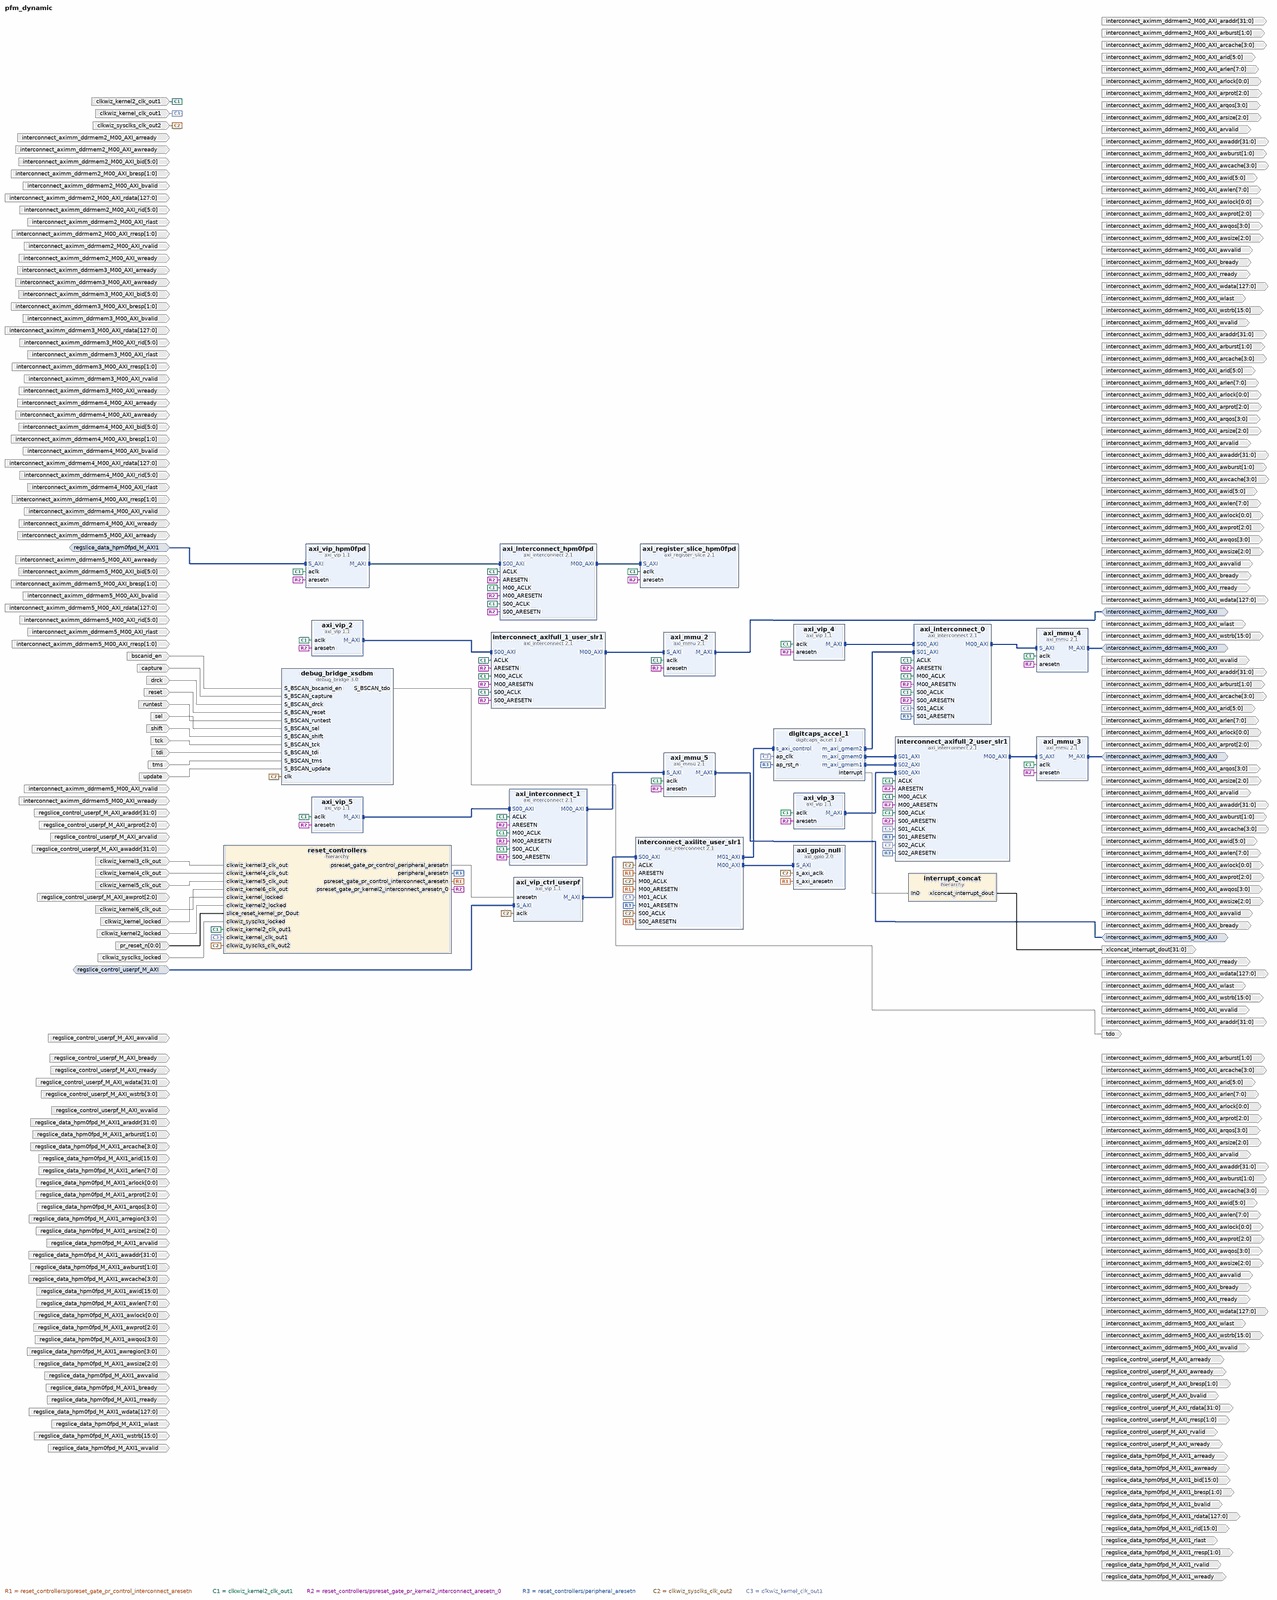
[diagram p0: block diagram of the top level, whole]
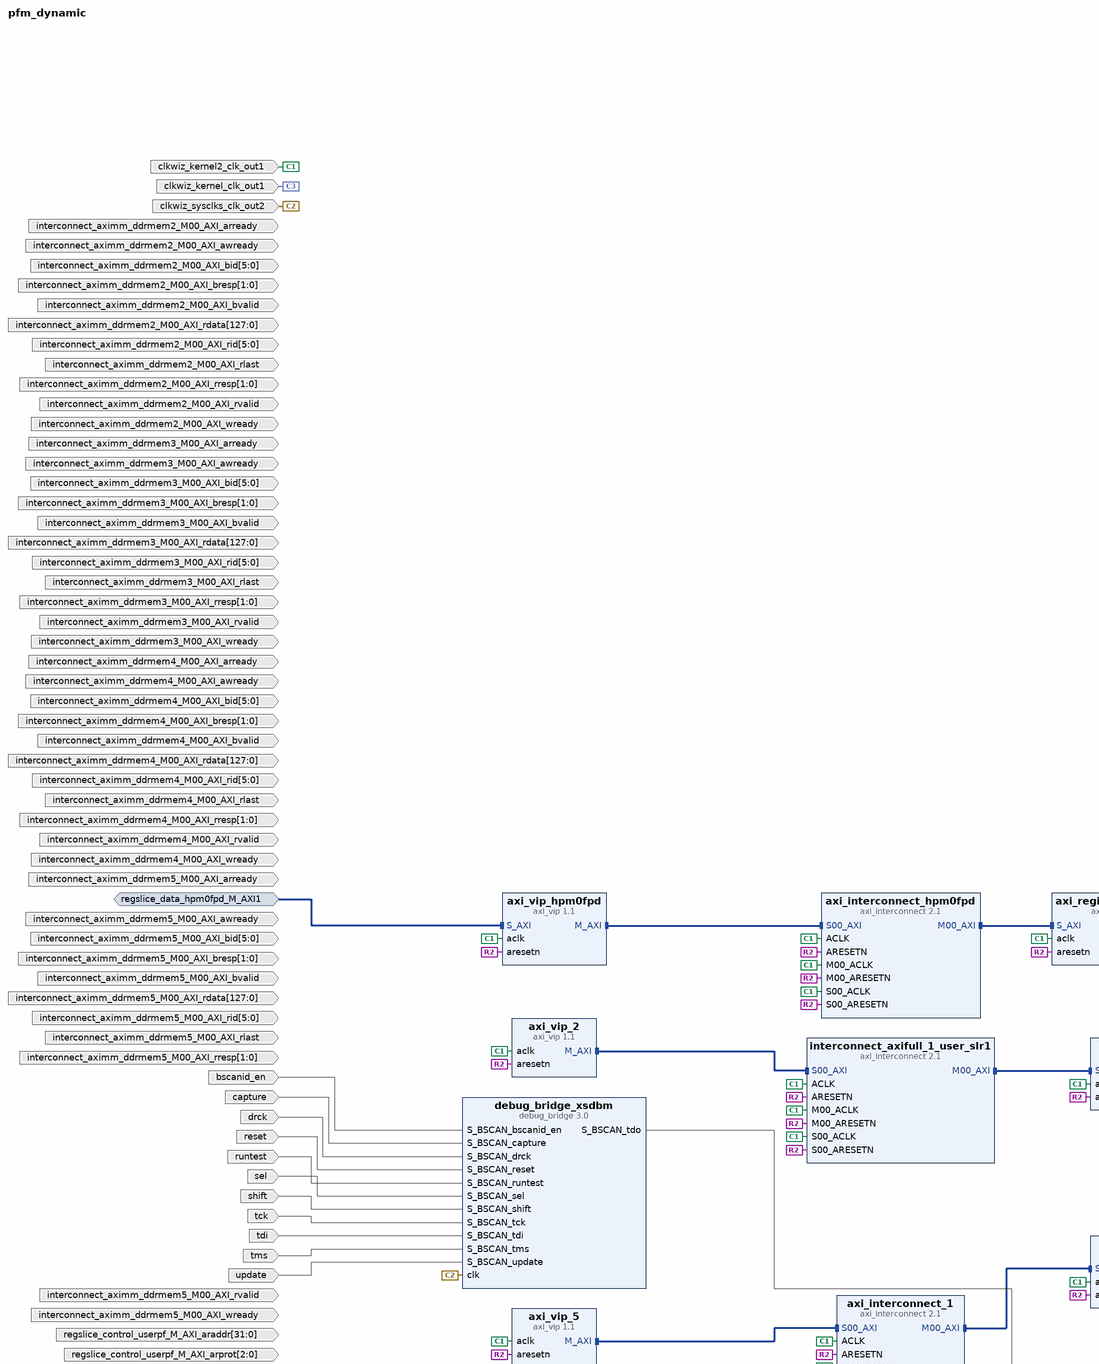
[diagram p1: block diagram of the top level, upper left part]
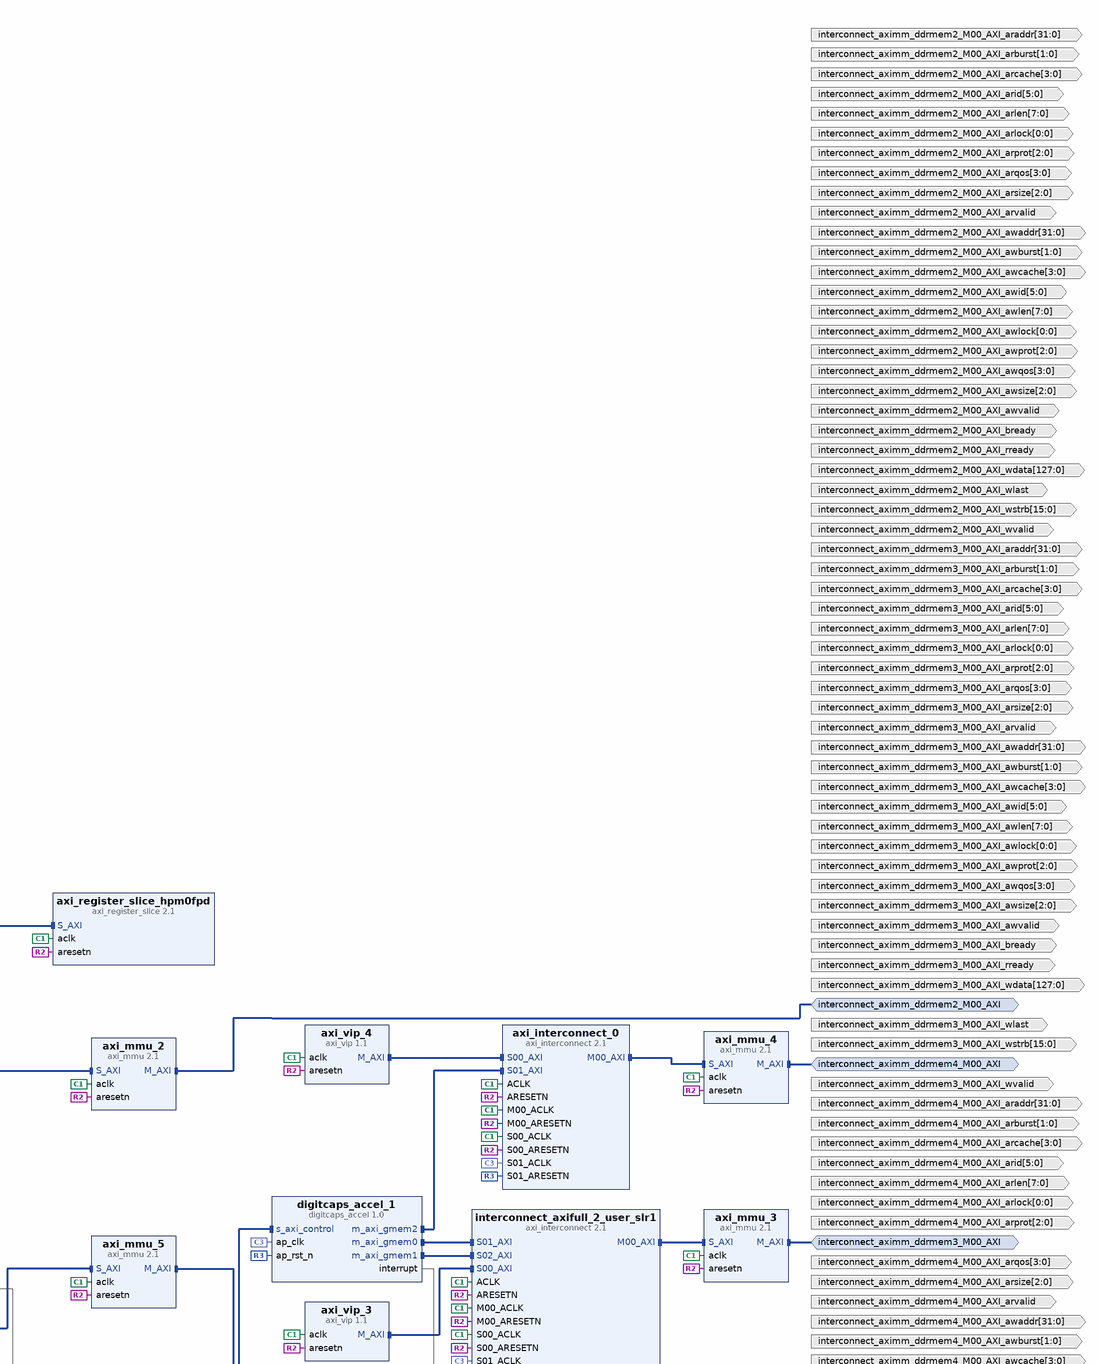
[diagram p2: block diagram of the top level, upper right part]
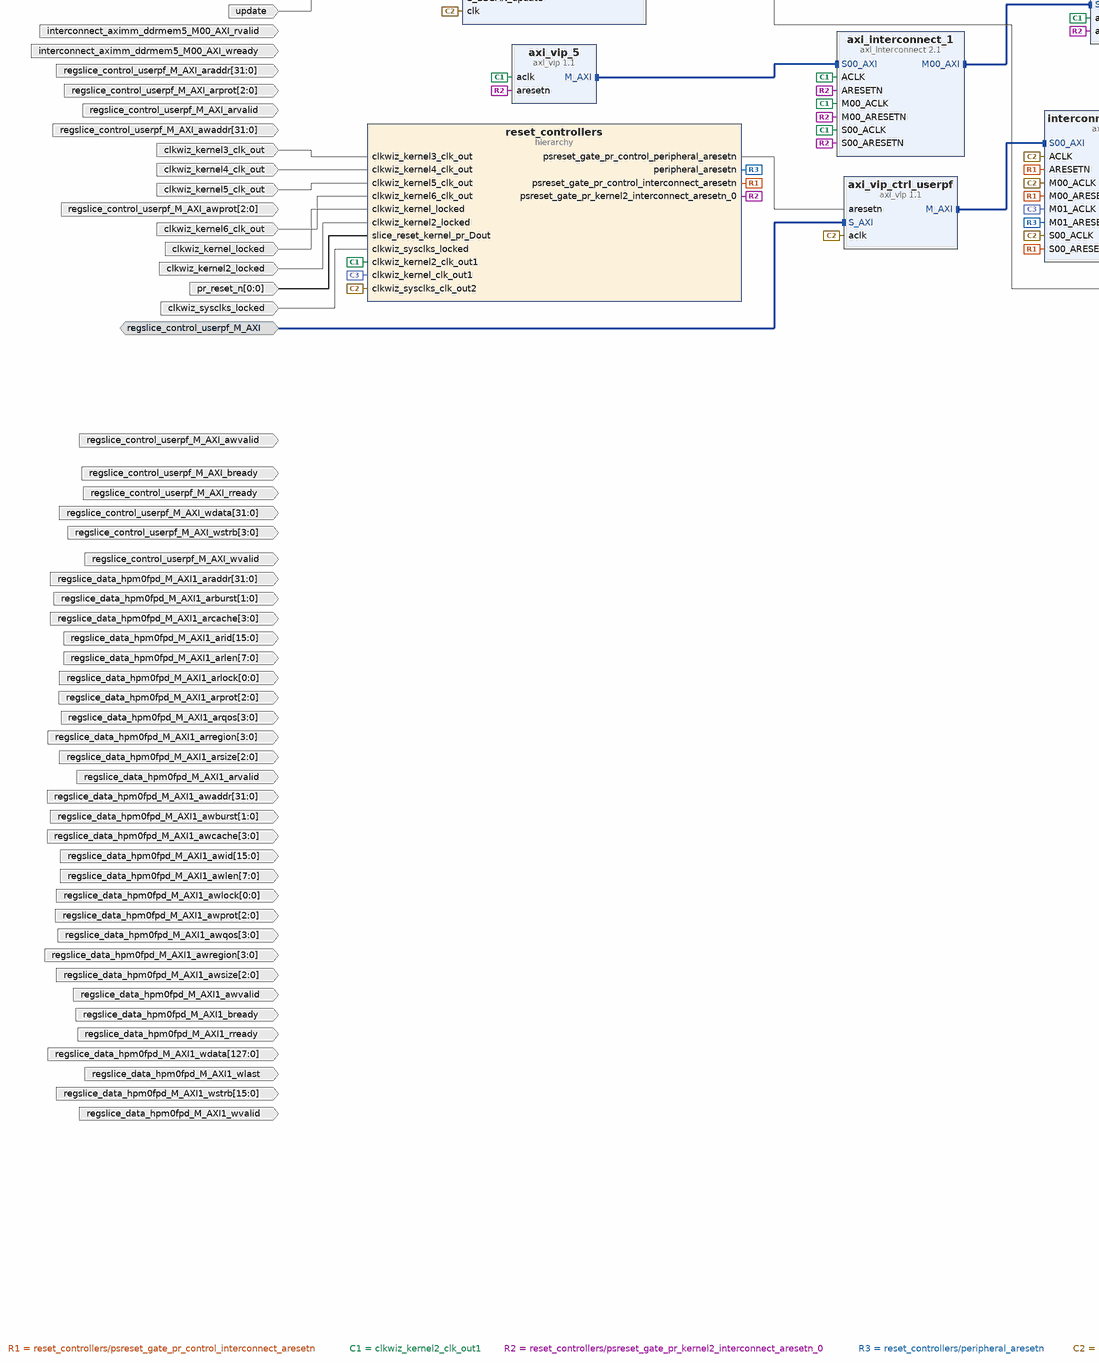
[diagram p3: block diagram of the top level, lower left part]
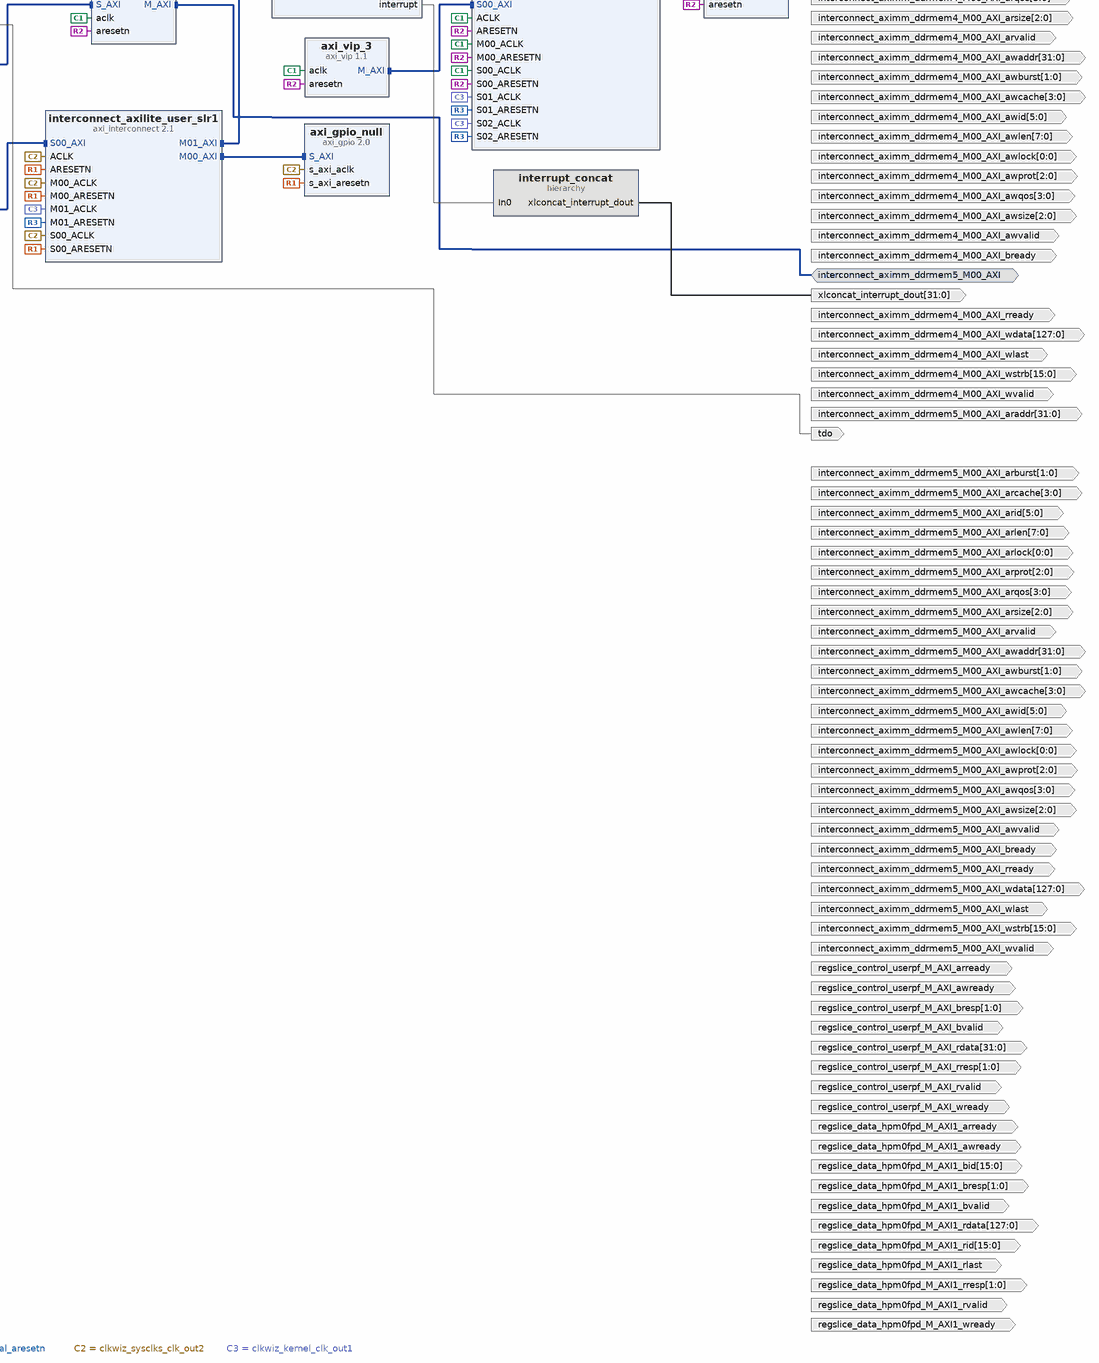
[diagram p4: block diagram of the top level, lower right part]
# Vivado block design pfm_dynamic, xczu9eg-ffvb1156-2-e, Vivado 2022.1
create_bd_design pfm_dynamic

create_bd_intf_port -mode Master -vlnv xilinx.com:interface:aximm_rtl:1.0 interconnect_aximm_ddrmem2_M00_AXI
set_property -dict [list \
  CONFIG.ADDR_WIDTH 32 \
  CONFIG.DATA_WIDTH 128 \
  CONFIG.FREQ_HZ 300000000 \
  CONFIG.HAS_REGION 1 \
  CONFIG.NUM_READ_OUTSTANDING 2 \
  CONFIG.NUM_WRITE_OUTSTANDING 2 \
  CONFIG.PROTOCOL AXI4 \
] [get_bd_intf_ports interconnect_aximm_ddrmem2_M00_AXI]
create_bd_intf_port -mode Master -vlnv xilinx.com:interface:aximm_rtl:1.0 interconnect_aximm_ddrmem3_M00_AXI
set_property -dict [list \
  CONFIG.ADDR_WIDTH 32 \
  CONFIG.DATA_WIDTH 128 \
  CONFIG.FREQ_HZ 300000000 \
  CONFIG.HAS_REGION 1 \
  CONFIG.NUM_READ_OUTSTANDING 2 \
  CONFIG.NUM_WRITE_OUTSTANDING 2 \
  CONFIG.PROTOCOL AXI4 \
] [get_bd_intf_ports interconnect_aximm_ddrmem3_M00_AXI]
create_bd_intf_port -mode Master -vlnv xilinx.com:interface:aximm_rtl:1.0 interconnect_aximm_ddrmem4_M00_AXI
set_property -dict [list \
  CONFIG.ADDR_WIDTH 32 \
  CONFIG.DATA_WIDTH 128 \
  CONFIG.FREQ_HZ 300000000 \
  CONFIG.HAS_REGION 1 \
  CONFIG.NUM_READ_OUTSTANDING 2 \
  CONFIG.NUM_WRITE_OUTSTANDING 2 \
  CONFIG.PROTOCOL AXI4 \
] [get_bd_intf_ports interconnect_aximm_ddrmem4_M00_AXI]
create_bd_intf_port -mode Master -vlnv xilinx.com:interface:aximm_rtl:1.0 interconnect_aximm_ddrmem5_M00_AXI
set_property -dict [list \
  CONFIG.ADDR_WIDTH 32 \
  CONFIG.DATA_WIDTH 128 \
  CONFIG.FREQ_HZ 300000000 \
  CONFIG.HAS_REGION 1 \
  CONFIG.NUM_READ_OUTSTANDING 2 \
  CONFIG.NUM_WRITE_OUTSTANDING 2 \
  CONFIG.PROTOCOL AXI4 \
] [get_bd_intf_ports interconnect_aximm_ddrmem5_M00_AXI]
create_bd_intf_port -mode Slave -vlnv xilinx.com:interface:aximm_rtl:1.0 regslice_control_userpf_M_AXI
set_property -dict [list \
  CONFIG.ADDR_WIDTH 32 \
  CONFIG.ARUSER_WIDTH 0 \
  CONFIG.AWUSER_WIDTH 0 \
  CONFIG.BUSER_WIDTH 0 \
  CONFIG.DATA_WIDTH 32 \
  CONFIG.FREQ_HZ 75000000 \
  CONFIG.HAS_BRESP 1 \
  CONFIG.HAS_BURST 0 \
  CONFIG.HAS_CACHE 0 \
  CONFIG.HAS_LOCK 0 \
  CONFIG.HAS_PROT 1 \
  CONFIG.HAS_QOS 0 \
  CONFIG.HAS_REGION 0 \
  CONFIG.HAS_RRESP 1 \
  CONFIG.HAS_WSTRB 1 \
  CONFIG.ID_WIDTH 0 \
  CONFIG.MAX_BURST_LENGTH 1 \
  CONFIG.NUM_READ_OUTSTANDING 1 \
  CONFIG.NUM_READ_THREADS 1 \
  CONFIG.NUM_WRITE_OUTSTANDING 1 \
  CONFIG.NUM_WRITE_THREADS 1 \
  CONFIG.PROTOCOL AXI4LITE \
  CONFIG.READ_WRITE_MODE READ_WRITE \
  CONFIG.RUSER_BITS_PER_BYTE 0 \
  CONFIG.RUSER_WIDTH 0 \
  CONFIG.SUPPORTS_NARROW_BURST 0 \
  CONFIG.WUSER_BITS_PER_BYTE 0 \
  CONFIG.WUSER_WIDTH 0 \
] [get_bd_intf_ports regslice_control_userpf_M_AXI]
create_bd_intf_port -mode Slave -vlnv xilinx.com:interface:aximm_rtl:1.0 regslice_data_hpm0fpd_M_AXI1
set_property -dict [list \
  CONFIG.ADDR_WIDTH 32 \
  CONFIG.ARUSER_WIDTH 0 \
  CONFIG.AWUSER_WIDTH 0 \
  CONFIG.BUSER_WIDTH 0 \
  CONFIG.DATA_WIDTH 128 \
  CONFIG.FREQ_HZ 300000000 \
  CONFIG.HAS_BRESP 1 \
  CONFIG.HAS_BURST 1 \
  CONFIG.HAS_CACHE 1 \
  CONFIG.HAS_LOCK 1 \
  CONFIG.HAS_PROT 1 \
  CONFIG.HAS_QOS 1 \
  CONFIG.HAS_REGION 1 \
  CONFIG.HAS_RRESP 1 \
  CONFIG.HAS_WSTRB 1 \
  CONFIG.ID_WIDTH 16 \
  CONFIG.MAX_BURST_LENGTH 256 \
  CONFIG.NUM_READ_OUTSTANDING 2 \
  CONFIG.NUM_READ_THREADS 1 \
  CONFIG.NUM_WRITE_OUTSTANDING 2 \
  CONFIG.NUM_WRITE_THREADS 1 \
  CONFIG.PROTOCOL AXI4 \
  CONFIG.READ_WRITE_MODE READ_WRITE \
  CONFIG.RUSER_BITS_PER_BYTE 0 \
  CONFIG.RUSER_WIDTH 0 \
  CONFIG.SUPPORTS_NARROW_BURST 1 \
  CONFIG.WUSER_BITS_PER_BYTE 0 \
  CONFIG.WUSER_WIDTH 0 \
] [get_bd_intf_ports regslice_data_hpm0fpd_M_AXI1]
create_bd_port -dir O -from 5 -to 0 interconnect_aximm_ddrmem3_M00_AXI_awid
create_bd_port -dir O -from 31 -to 0 interconnect_aximm_ddrmem3_M00_AXI_awaddr
create_bd_port -dir O -from 7 -to 0 interconnect_aximm_ddrmem3_M00_AXI_awlen
create_bd_port -dir O -from 2 -to 0 interconnect_aximm_ddrmem3_M00_AXI_awsize
create_bd_port -dir O -from 1 -to 0 interconnect_aximm_ddrmem3_M00_AXI_awburst
create_bd_port -dir O -from 0 -to 0 interconnect_aximm_ddrmem3_M00_AXI_awlock
create_bd_port -dir O -from 3 -to 0 interconnect_aximm_ddrmem3_M00_AXI_awcache
create_bd_port -dir O -from 2 -to 0 interconnect_aximm_ddrmem3_M00_AXI_awprot
create_bd_port -dir O -from 3 -to 0 interconnect_aximm_ddrmem3_M00_AXI_awqos
create_bd_port -dir O interconnect_aximm_ddrmem3_M00_AXI_awvalid
create_bd_port -dir I interconnect_aximm_ddrmem3_M00_AXI_awready
create_bd_port -dir O -from 127 -to 0 interconnect_aximm_ddrmem3_M00_AXI_wdata
create_bd_port -dir O -from 15 -to 0 interconnect_aximm_ddrmem3_M00_AXI_wstrb
create_bd_port -dir O interconnect_aximm_ddrmem3_M00_AXI_wlast
create_bd_port -dir O interconnect_aximm_ddrmem3_M00_AXI_wvalid
create_bd_port -dir I interconnect_aximm_ddrmem3_M00_AXI_wready
create_bd_port -dir I -from 5 -to 0 interconnect_aximm_ddrmem3_M00_AXI_bid
create_bd_port -dir I -from 1 -to 0 interconnect_aximm_ddrmem3_M00_AXI_bresp
create_bd_port -dir I interconnect_aximm_ddrmem3_M00_AXI_bvalid
create_bd_port -dir O interconnect_aximm_ddrmem3_M00_AXI_bready
create_bd_port -dir O -from 5 -to 0 interconnect_aximm_ddrmem3_M00_AXI_arid
create_bd_port -dir O -from 31 -to 0 interconnect_aximm_ddrmem3_M00_AXI_araddr
create_bd_port -dir O -from 7 -to 0 interconnect_aximm_ddrmem3_M00_AXI_arlen
create_bd_port -dir O -from 2 -to 0 interconnect_aximm_ddrmem3_M00_AXI_arsize
create_bd_port -dir O -from 1 -to 0 interconnect_aximm_ddrmem3_M00_AXI_arburst
create_bd_port -dir O -from 0 -to 0 interconnect_aximm_ddrmem3_M00_AXI_arlock
create_bd_port -dir O -from 3 -to 0 interconnect_aximm_ddrmem3_M00_AXI_arcache
create_bd_port -dir O -from 2 -to 0 interconnect_aximm_ddrmem3_M00_AXI_arprot
create_bd_port -dir O -from 3 -to 0 interconnect_aximm_ddrmem3_M00_AXI_arqos
create_bd_port -dir O interconnect_aximm_ddrmem3_M00_AXI_arvalid
create_bd_port -dir I interconnect_aximm_ddrmem3_M00_AXI_arready
create_bd_port -dir I -from 5 -to 0 interconnect_aximm_ddrmem3_M00_AXI_rid
create_bd_port -dir I -from 127 -to 0 interconnect_aximm_ddrmem3_M00_AXI_rdata
create_bd_port -dir I -from 1 -to 0 interconnect_aximm_ddrmem3_M00_AXI_rresp
create_bd_port -dir I interconnect_aximm_ddrmem3_M00_AXI_rlast
create_bd_port -dir I interconnect_aximm_ddrmem3_M00_AXI_rvalid
create_bd_port -dir O interconnect_aximm_ddrmem3_M00_AXI_rready
create_bd_port -dir O -from 5 -to 0 interconnect_aximm_ddrmem2_M00_AXI_awid
create_bd_port -dir O -from 31 -to 0 interconnect_aximm_ddrmem2_M00_AXI_awaddr
create_bd_port -dir O -from 7 -to 0 interconnect_aximm_ddrmem2_M00_AXI_awlen
create_bd_port -dir O -from 2 -to 0 interconnect_aximm_ddrmem2_M00_AXI_awsize
create_bd_port -dir O -from 1 -to 0 interconnect_aximm_ddrmem2_M00_AXI_awburst
create_bd_port -dir O -from 0 -to 0 interconnect_aximm_ddrmem2_M00_AXI_awlock
create_bd_port -dir O -from 3 -to 0 interconnect_aximm_ddrmem2_M00_AXI_awcache
create_bd_port -dir O -from 2 -to 0 interconnect_aximm_ddrmem2_M00_AXI_awprot
create_bd_port -dir O -from 3 -to 0 interconnect_aximm_ddrmem2_M00_AXI_awqos
create_bd_port -dir O interconnect_aximm_ddrmem2_M00_AXI_awvalid
create_bd_port -dir I interconnect_aximm_ddrmem2_M00_AXI_awready
create_bd_port -dir O -from 127 -to 0 interconnect_aximm_ddrmem2_M00_AXI_wdata
create_bd_port -dir O -from 15 -to 0 interconnect_aximm_ddrmem2_M00_AXI_wstrb
create_bd_port -dir O interconnect_aximm_ddrmem2_M00_AXI_wlast
create_bd_port -dir O interconnect_aximm_ddrmem2_M00_AXI_wvalid
create_bd_port -dir I interconnect_aximm_ddrmem2_M00_AXI_wready
create_bd_port -dir I -from 5 -to 0 interconnect_aximm_ddrmem2_M00_AXI_bid
create_bd_port -dir I -from 1 -to 0 interconnect_aximm_ddrmem2_M00_AXI_bresp
create_bd_port -dir I interconnect_aximm_ddrmem2_M00_AXI_bvalid
create_bd_port -dir O interconnect_aximm_ddrmem2_M00_AXI_bready
create_bd_port -dir O -from 5 -to 0 interconnect_aximm_ddrmem2_M00_AXI_arid
create_bd_port -dir O -from 31 -to 0 interconnect_aximm_ddrmem2_M00_AXI_araddr
create_bd_port -dir O -from 7 -to 0 interconnect_aximm_ddrmem2_M00_AXI_arlen
create_bd_port -dir O -from 2 -to 0 interconnect_aximm_ddrmem2_M00_AXI_arsize
create_bd_port -dir O -from 1 -to 0 interconnect_aximm_ddrmem2_M00_AXI_arburst
create_bd_port -dir O -from 0 -to 0 interconnect_aximm_ddrmem2_M00_AXI_arlock
create_bd_port -dir O -from 3 -to 0 interconnect_aximm_ddrmem2_M00_AXI_arcache
create_bd_port -dir O -from 2 -to 0 interconnect_aximm_ddrmem2_M00_AXI_arprot
create_bd_port -dir O -from 3 -to 0 interconnect_aximm_ddrmem2_M00_AXI_arqos
create_bd_port -dir O interconnect_aximm_ddrmem2_M00_AXI_arvalid
create_bd_port -dir I interconnect_aximm_ddrmem2_M00_AXI_arready
create_bd_port -dir I -from 5 -to 0 interconnect_aximm_ddrmem2_M00_AXI_rid
create_bd_port -dir I -from 127 -to 0 interconnect_aximm_ddrmem2_M00_AXI_rdata
create_bd_port -dir I -from 1 -to 0 interconnect_aximm_ddrmem2_M00_AXI_rresp
create_bd_port -dir I interconnect_aximm_ddrmem2_M00_AXI_rlast
create_bd_port -dir I interconnect_aximm_ddrmem2_M00_AXI_rvalid
create_bd_port -dir O interconnect_aximm_ddrmem2_M00_AXI_rready
create_bd_port -dir O -from 5 -to 0 interconnect_aximm_ddrmem4_M00_AXI_awid
create_bd_port -dir O -from 31 -to 0 interconnect_aximm_ddrmem4_M00_AXI_awaddr
create_bd_port -dir O -from 7 -to 0 interconnect_aximm_ddrmem4_M00_AXI_awlen
create_bd_port -dir O -from 2 -to 0 interconnect_aximm_ddrmem4_M00_AXI_awsize
create_bd_port -dir O -from 1 -to 0 interconnect_aximm_ddrmem4_M00_AXI_awburst
create_bd_port -dir O -from 0 -to 0 interconnect_aximm_ddrmem4_M00_AXI_awlock
create_bd_port -dir O -from 3 -to 0 interconnect_aximm_ddrmem4_M00_AXI_awcache
create_bd_port -dir O -from 2 -to 0 interconnect_aximm_ddrmem4_M00_AXI_awprot
create_bd_port -dir O -from 3 -to 0 interconnect_aximm_ddrmem4_M00_AXI_awqos
create_bd_port -dir O interconnect_aximm_ddrmem4_M00_AXI_awvalid
create_bd_port -dir I interconnect_aximm_ddrmem4_M00_AXI_awready
create_bd_port -dir O -from 127 -to 0 interconnect_aximm_ddrmem4_M00_AXI_wdata
create_bd_port -dir O -from 15 -to 0 interconnect_aximm_ddrmem4_M00_AXI_wstrb
create_bd_port -dir O interconnect_aximm_ddrmem4_M00_AXI_wlast
create_bd_port -dir O interconnect_aximm_ddrmem4_M00_AXI_wvalid
create_bd_port -dir I interconnect_aximm_ddrmem4_M00_AXI_wready
create_bd_port -dir I -from 5 -to 0 interconnect_aximm_ddrmem4_M00_AXI_bid
create_bd_port -dir I -from 1 -to 0 interconnect_aximm_ddrmem4_M00_AXI_bresp
create_bd_port -dir I interconnect_aximm_ddrmem4_M00_AXI_bvalid
create_bd_port -dir O interconnect_aximm_ddrmem4_M00_AXI_bready
create_bd_port -dir O -from 5 -to 0 interconnect_aximm_ddrmem4_M00_AXI_arid
create_bd_port -dir O -from 31 -to 0 interconnect_aximm_ddrmem4_M00_AXI_araddr
create_bd_port -dir O -from 7 -to 0 interconnect_aximm_ddrmem4_M00_AXI_arlen
create_bd_port -dir O -from 2 -to 0 interconnect_aximm_ddrmem4_M00_AXI_arsize
create_bd_port -dir O -from 1 -to 0 interconnect_aximm_ddrmem4_M00_AXI_arburst
create_bd_port -dir O -from 0 -to 0 interconnect_aximm_ddrmem4_M00_AXI_arlock
create_bd_port -dir O -from 3 -to 0 interconnect_aximm_ddrmem4_M00_AXI_arcache
create_bd_port -dir O -from 2 -to 0 interconnect_aximm_ddrmem4_M00_AXI_arprot
create_bd_port -dir O -from 3 -to 0 interconnect_aximm_ddrmem4_M00_AXI_arqos
create_bd_port -dir O interconnect_aximm_ddrmem4_M00_AXI_arvalid
create_bd_port -dir I interconnect_aximm_ddrmem4_M00_AXI_arready
create_bd_port -dir I -from 5 -to 0 interconnect_aximm_ddrmem4_M00_AXI_rid
create_bd_port -dir I -from 127 -to 0 interconnect_aximm_ddrmem4_M00_AXI_rdata
create_bd_port -dir I -from 1 -to 0 interconnect_aximm_ddrmem4_M00_AXI_rresp
create_bd_port -dir I interconnect_aximm_ddrmem4_M00_AXI_rlast
create_bd_port -dir I interconnect_aximm_ddrmem4_M00_AXI_rvalid
create_bd_port -dir O interconnect_aximm_ddrmem4_M00_AXI_rready
create_bd_port -dir O -from 5 -to 0 interconnect_aximm_ddrmem5_M00_AXI_awid
create_bd_port -dir O -from 31 -to 0 interconnect_aximm_ddrmem5_M00_AXI_awaddr
create_bd_port -dir O -from 7 -to 0 interconnect_aximm_ddrmem5_M00_AXI_awlen
create_bd_port -dir O -from 2 -to 0 interconnect_aximm_ddrmem5_M00_AXI_awsize
create_bd_port -dir O -from 1 -to 0 interconnect_aximm_ddrmem5_M00_AXI_awburst
create_bd_port -dir O -from 0 -to 0 interconnect_aximm_ddrmem5_M00_AXI_awlock
create_bd_port -dir O -from 3 -to 0 interconnect_aximm_ddrmem5_M00_AXI_awcache
create_bd_port -dir O -from 2 -to 0 interconnect_aximm_ddrmem5_M00_AXI_awprot
create_bd_port -dir O -from 3 -to 0 interconnect_aximm_ddrmem5_M00_AXI_awqos
create_bd_port -dir O interconnect_aximm_ddrmem5_M00_AXI_awvalid
create_bd_port -dir I interconnect_aximm_ddrmem5_M00_AXI_awready
create_bd_port -dir O -from 127 -to 0 interconnect_aximm_ddrmem5_M00_AXI_wdata
create_bd_port -dir O -from 15 -to 0 interconnect_aximm_ddrmem5_M00_AXI_wstrb
create_bd_port -dir O interconnect_aximm_ddrmem5_M00_AXI_wlast
create_bd_port -dir O interconnect_aximm_ddrmem5_M00_AXI_wvalid
create_bd_port -dir I interconnect_aximm_ddrmem5_M00_AXI_wready
create_bd_port -dir I -from 5 -to 0 interconnect_aximm_ddrmem5_M00_AXI_bid
create_bd_port -dir I -from 1 -to 0 interconnect_aximm_ddrmem5_M00_AXI_bresp
create_bd_port -dir I interconnect_aximm_ddrmem5_M00_AXI_bvalid
create_bd_port -dir O interconnect_aximm_ddrmem5_M00_AXI_bready
create_bd_port -dir O -from 5 -to 0 interconnect_aximm_ddrmem5_M00_AXI_arid
create_bd_port -dir O -from 31 -to 0 interconnect_aximm_ddrmem5_M00_AXI_araddr
create_bd_port -dir O -from 7 -to 0 interconnect_aximm_ddrmem5_M00_AXI_arlen
create_bd_port -dir O -from 2 -to 0 interconnect_aximm_ddrmem5_M00_AXI_arsize
create_bd_port -dir O -from 1 -to 0 interconnect_aximm_ddrmem5_M00_AXI_arburst
create_bd_port -dir O -from 0 -to 0 interconnect_aximm_ddrmem5_M00_AXI_arlock
create_bd_port -dir O -from 3 -to 0 interconnect_aximm_ddrmem5_M00_AXI_arcache
create_bd_port -dir O -from 2 -to 0 interconnect_aximm_ddrmem5_M00_AXI_arprot
create_bd_port -dir O -from 3 -to 0 interconnect_aximm_ddrmem5_M00_AXI_arqos
create_bd_port -dir O interconnect_aximm_ddrmem5_M00_AXI_arvalid
create_bd_port -dir I interconnect_aximm_ddrmem5_M00_AXI_arready
create_bd_port -dir I -from 5 -to 0 interconnect_aximm_ddrmem5_M00_AXI_rid
create_bd_port -dir I -from 127 -to 0 interconnect_aximm_ddrmem5_M00_AXI_rdata
create_bd_port -dir I -from 1 -to 0 interconnect_aximm_ddrmem5_M00_AXI_rresp
create_bd_port -dir I interconnect_aximm_ddrmem5_M00_AXI_rlast
create_bd_port -dir I interconnect_aximm_ddrmem5_M00_AXI_rvalid
create_bd_port -dir O interconnect_aximm_ddrmem5_M00_AXI_rready
create_bd_port -dir I -from 31 -to 0 regslice_data_hpm0fpd_M_AXI1_araddr
create_bd_port -dir I -from 1 -to 0 regslice_data_hpm0fpd_M_AXI1_arburst
create_bd_port -dir I -from 3 -to 0 regslice_data_hpm0fpd_M_AXI1_arcache
create_bd_port -dir I -from 7 -to 0 regslice_data_hpm0fpd_M_AXI1_arlen
create_bd_port -dir I -from 0 -to 0 regslice_data_hpm0fpd_M_AXI1_arlock
create_bd_port -dir I -from 2 -to 0 regslice_data_hpm0fpd_M_AXI1_arprot
create_bd_port -dir I -from 3 -to 0 regslice_data_hpm0fpd_M_AXI1_arqos
create_bd_port -dir O regslice_data_hpm0fpd_M_AXI1_arready
create_bd_port -dir I -from 3 -to 0 regslice_data_hpm0fpd_M_AXI1_arregion
create_bd_port -dir I -from 2 -to 0 regslice_data_hpm0fpd_M_AXI1_arsize
create_bd_port -dir I regslice_data_hpm0fpd_M_AXI1_arvalid
create_bd_port -dir I -from 31 -to 0 regslice_data_hpm0fpd_M_AXI1_awaddr
create_bd_port -dir I -from 1 -to 0 regslice_data_hpm0fpd_M_AXI1_awburst
create_bd_port -dir I -from 3 -to 0 regslice_data_hpm0fpd_M_AXI1_awcache
create_bd_port -dir I -from 7 -to 0 regslice_data_hpm0fpd_M_AXI1_awlen
create_bd_port -dir I -from 0 -to 0 regslice_data_hpm0fpd_M_AXI1_awlock
create_bd_port -dir I -from 2 -to 0 regslice_data_hpm0fpd_M_AXI1_awprot
create_bd_port -dir I -from 3 -to 0 regslice_data_hpm0fpd_M_AXI1_awqos
create_bd_port -dir O regslice_data_hpm0fpd_M_AXI1_awready
create_bd_port -dir I -from 3 -to 0 regslice_data_hpm0fpd_M_AXI1_awregion
create_bd_port -dir I -from 2 -to 0 regslice_data_hpm0fpd_M_AXI1_awsize
create_bd_port -dir I regslice_data_hpm0fpd_M_AXI1_awvalid
create_bd_port -dir I regslice_data_hpm0fpd_M_AXI1_bready
create_bd_port -dir O -from 1 -to 0 regslice_data_hpm0fpd_M_AXI1_bresp
create_bd_port -dir O regslice_data_hpm0fpd_M_AXI1_bvalid
create_bd_port -dir O -from 127 -to 0 regslice_data_hpm0fpd_M_AXI1_rdata
create_bd_port -dir O regslice_data_hpm0fpd_M_AXI1_rlast
create_bd_port -dir I regslice_data_hpm0fpd_M_AXI1_rready
create_bd_port -dir O -from 1 -to 0 regslice_data_hpm0fpd_M_AXI1_rresp
create_bd_port -dir O regslice_data_hpm0fpd_M_AXI1_rvalid
create_bd_port -dir I -from 127 -to 0 regslice_data_hpm0fpd_M_AXI1_wdata
create_bd_port -dir I regslice_data_hpm0fpd_M_AXI1_wlast
create_bd_port -dir O regslice_data_hpm0fpd_M_AXI1_wready
create_bd_port -dir I -from 15 -to 0 regslice_data_hpm0fpd_M_AXI1_wstrb
create_bd_port -dir I regslice_data_hpm0fpd_M_AXI1_wvalid
create_bd_port -dir I -from 15 -to 0 regslice_data_hpm0fpd_M_AXI1_arid
create_bd_port -dir I -from 15 -to 0 regslice_data_hpm0fpd_M_AXI1_awid
create_bd_port -dir O -from 15 -to 0 regslice_data_hpm0fpd_M_AXI1_bid
create_bd_port -dir O -from 15 -to 0 regslice_data_hpm0fpd_M_AXI1_rid
create_bd_port -dir I -from 31 -to 0 regslice_control_userpf_M_AXI_araddr
create_bd_port -dir I -from 2 -to 0 regslice_control_userpf_M_AXI_arprot
create_bd_port -dir O regslice_control_userpf_M_AXI_arready
create_bd_port -dir I regslice_control_userpf_M_AXI_arvalid
create_bd_port -dir I -from 31 -to 0 regslice_control_userpf_M_AXI_awaddr
create_bd_port -dir I -from 2 -to 0 regslice_control_userpf_M_AXI_awprot
create_bd_port -dir O regslice_control_userpf_M_AXI_awready
create_bd_port -dir I regslice_control_userpf_M_AXI_awvalid
create_bd_port -dir I regslice_control_userpf_M_AXI_bready
create_bd_port -dir O -from 1 -to 0 regslice_control_userpf_M_AXI_bresp
create_bd_port -dir O regslice_control_userpf_M_AXI_bvalid
create_bd_port -dir O -from 31 -to 0 regslice_control_userpf_M_AXI_rdata
create_bd_port -dir I regslice_control_userpf_M_AXI_rready
create_bd_port -dir O -from 1 -to 0 regslice_control_userpf_M_AXI_rresp
create_bd_port -dir O regslice_control_userpf_M_AXI_rvalid
create_bd_port -dir I -from 31 -to 0 regslice_control_userpf_M_AXI_wdata
create_bd_port -dir O regslice_control_userpf_M_AXI_wready
create_bd_port -dir I -from 3 -to 0 regslice_control_userpf_M_AXI_wstrb
create_bd_port -dir I regslice_control_userpf_M_AXI_wvalid
create_bd_port -dir I bscanid_en
create_bd_port -dir I capture
create_bd_port -dir I -type clk clkwiz_kernel2_clk_out1
set_property -dict {CONFIG.FREQ_HZ 300000000} [get_bd_ports clkwiz_kernel2_clk_out1]
create_bd_port -dir I clkwiz_kernel2_locked
create_bd_port -dir I -type clk clkwiz_kernel3_clk_out
set_property -dict {CONFIG.FREQ_HZ 100000000} [get_bd_ports clkwiz_kernel3_clk_out]
create_bd_port -dir I -type clk clkwiz_kernel4_clk_out
set_property -dict {CONFIG.FREQ_HZ 200000000} [get_bd_ports clkwiz_kernel4_clk_out]
create_bd_port -dir I -type clk clkwiz_kernel5_clk_out
set_property -dict {CONFIG.FREQ_HZ 400000000} [get_bd_ports clkwiz_kernel5_clk_out]
create_bd_port -dir I -type clk clkwiz_kernel6_clk_out
set_property -dict {CONFIG.FREQ_HZ 600000000} [get_bd_ports clkwiz_kernel6_clk_out]
create_bd_port -dir I -type clk clkwiz_kernel_clk_out1
set_property -dict {CONFIG.FREQ_HZ 150000000} [get_bd_ports clkwiz_kernel_clk_out1]
create_bd_port -dir I clkwiz_kernel_locked
create_bd_port -dir I -type clk clkwiz_sysclks_clk_out2
set_property -dict {CONFIG.FREQ_HZ 75000000} [get_bd_ports clkwiz_sysclks_clk_out2]
create_bd_port -dir I -type rst clkwiz_sysclks_locked
create_bd_port -dir I drck
create_bd_port -dir I -from 0 -to 0 -type rst pr_reset_n
create_bd_port -dir I reset
create_bd_port -dir I runtest
create_bd_port -dir I sel
create_bd_port -dir I shift
create_bd_port -dir I tck
create_bd_port -dir I tdi
create_bd_port -dir O tdo
create_bd_port -dir I tms
create_bd_port -dir I update
create_bd_port -dir O -from 31 -to 0 xlconcat_interrupt_dout

create_bd_cell -type ip -vlnv xilinx.com:ip:axi_gpio:2.0 axi_gpio_null
create_bd_cell -type ip -vlnv xilinx.com:ip:axi_mmu:2.1 axi_mmu_2
set_property -dict {CONFIG.D000_ADDR_WIDTH 32 CONFIG.ID_WIDTH 6} [get_bd_cells axi_mmu_2]
create_bd_cell -type ip -vlnv xilinx.com:ip:axi_mmu:2.1 axi_mmu_3
set_property -dict {CONFIG.D000_ADDR_WIDTH 32 CONFIG.ID_WIDTH 6} [get_bd_cells axi_mmu_3]
create_bd_cell -type ip -vlnv xilinx.com:ip:axi_mmu:2.1 axi_mmu_4
set_property -dict {CONFIG.D000_ADDR_WIDTH 32 CONFIG.ID_WIDTH 6} [get_bd_cells axi_mmu_4]
create_bd_cell -type ip -vlnv xilinx.com:ip:axi_mmu:2.1 axi_mmu_5
set_property -dict {CONFIG.D000_ADDR_WIDTH 32 CONFIG.ID_WIDTH 6} [get_bd_cells axi_mmu_5]
create_bd_cell -type ip -vlnv xilinx.com:ip:axi_register_slice:2.1 axi_register_slice_hpm0fpd
set_property -dict {CONFIG.DATA_WIDTH 128} [get_bd_cells axi_register_slice_hpm0fpd]
create_bd_cell -type ip -vlnv xilinx.com:ip:axi_vip:1.1 axi_vip_2
set_property -dict [list \
  CONFIG.ADDR_WIDTH 32 \
  CONFIG.ARUSER_WIDTH 0 \
  CONFIG.AWUSER_WIDTH 0 \
  CONFIG.BUSER_WIDTH 0 \
  CONFIG.DATA_WIDTH 128 \
  CONFIG.HAS_BRESP 1 \
  CONFIG.HAS_BURST 1 \
  CONFIG.HAS_CACHE 1 \
  CONFIG.HAS_LOCK 1 \
  CONFIG.HAS_PROT 1 \
  CONFIG.HAS_QOS 1 \
  CONFIG.HAS_REGION 1 \
  CONFIG.HAS_RRESP 1 \
  CONFIG.HAS_WSTRB 1 \
  CONFIG.ID_WIDTH 0 \
  CONFIG.INTERFACE_MODE MASTER \
  CONFIG.PROTOCOL AXI4 \
  CONFIG.READ_WRITE_MODE READ_WRITE \
  CONFIG.RUSER_WIDTH 0 \
  CONFIG.SUPPORTS_NARROW 1 \
  CONFIG.WUSER_WIDTH 0 \
] [get_bd_cells axi_vip_2]
create_bd_cell -type ip -vlnv xilinx.com:ip:axi_vip:1.1 axi_vip_3
set_property -dict [list \
  CONFIG.ADDR_WIDTH 32 \
  CONFIG.ARUSER_WIDTH 0 \
  CONFIG.AWUSER_WIDTH 0 \
  CONFIG.BUSER_WIDTH 0 \
  CONFIG.DATA_WIDTH 128 \
  CONFIG.HAS_BRESP 1 \
  CONFIG.HAS_BURST 1 \
  CONFIG.HAS_CACHE 1 \
  CONFIG.HAS_LOCK 1 \
  CONFIG.HAS_PROT 1 \
  CONFIG.HAS_QOS 1 \
  CONFIG.HAS_REGION 1 \
  CONFIG.HAS_RRESP 1 \
  CONFIG.HAS_WSTRB 1 \
  CONFIG.ID_WIDTH 0 \
  CONFIG.INTERFACE_MODE MASTER \
  CONFIG.PROTOCOL AXI4 \
  CONFIG.READ_WRITE_MODE READ_WRITE \
  CONFIG.RUSER_WIDTH 0 \
  CONFIG.SUPPORTS_NARROW 1 \
  CONFIG.WUSER_WIDTH 0 \
] [get_bd_cells axi_vip_3]
create_bd_cell -type ip -vlnv xilinx.com:ip:axi_vip:1.1 axi_vip_4
set_property -dict [list \
  CONFIG.ADDR_WIDTH 32 \
  CONFIG.ARUSER_WIDTH 0 \
  CONFIG.AWUSER_WIDTH 0 \
  CONFIG.BUSER_WIDTH 0 \
  CONFIG.DATA_WIDTH 128 \
  CONFIG.HAS_BRESP 1 \
  CONFIG.HAS_BURST 1 \
  CONFIG.HAS_CACHE 1 \
  CONFIG.HAS_LOCK 1 \
  CONFIG.HAS_PROT 1 \
  CONFIG.HAS_QOS 1 \
  CONFIG.HAS_REGION 1 \
  CONFIG.HAS_RRESP 1 \
  CONFIG.HAS_WSTRB 1 \
  CONFIG.ID_WIDTH 0 \
  CONFIG.INTERFACE_MODE MASTER \
  CONFIG.PROTOCOL AXI4 \
  CONFIG.READ_WRITE_MODE READ_WRITE \
  CONFIG.RUSER_WIDTH 0 \
  CONFIG.SUPPORTS_NARROW 1 \
  CONFIG.WUSER_WIDTH 0 \
] [get_bd_cells axi_vip_4]
create_bd_cell -type ip -vlnv xilinx.com:ip:axi_vip:1.1 axi_vip_5
set_property -dict [list \
  CONFIG.ADDR_WIDTH 32 \
  CONFIG.ARUSER_WIDTH 0 \
  CONFIG.AWUSER_WIDTH 0 \
  CONFIG.BUSER_WIDTH 0 \
  CONFIG.DATA_WIDTH 128 \
  CONFIG.HAS_BRESP 1 \
  CONFIG.HAS_BURST 1 \
  CONFIG.HAS_CACHE 1 \
  CONFIG.HAS_LOCK 1 \
  CONFIG.HAS_PROT 1 \
  CONFIG.HAS_QOS 1 \
  CONFIG.HAS_REGION 1 \
  CONFIG.HAS_RRESP 1 \
  CONFIG.HAS_WSTRB 1 \
  CONFIG.ID_WIDTH 0 \
  CONFIG.INTERFACE_MODE MASTER \
  CONFIG.PROTOCOL AXI4 \
  CONFIG.READ_WRITE_MODE READ_WRITE \
  CONFIG.RUSER_WIDTH 0 \
  CONFIG.SUPPORTS_NARROW 1 \
  CONFIG.WUSER_WIDTH 0 \
] [get_bd_cells axi_vip_5]
create_bd_cell -type ip -vlnv xilinx.com:ip:axi_vip:1.1 axi_vip_ctrl_userpf
create_bd_cell -type ip -vlnv xilinx.com:ip:axi_vip:1.1 axi_vip_hpm0fpd
create_bd_cell -type ip -vlnv xilinx.com:ip:debug_bridge:3.0 debug_bridge_xsdbm
set_property -dict [list \
  CONFIG.C_DEBUG_MODE 1 \
  CONFIG.C_DESIGN_TYPE 1 \
  CONFIG.C_ENABLE_CLK_DIVIDER false \
] [get_bd_cells debug_bridge_xsdbm]
create_bd_cell -type hier interrupt_concat
create_bd_cell -type hier reset_controllers
create_bd_cell -type ip -vlnv xilinx.com:ip:axi_interconnect:2.1 axi_interconnect_0
set_property -dict [list \
  CONFIG.M00_HAS_REGSLICE 4 \
  CONFIG.M01_HAS_REGSLICE 4 \
  CONFIG.M02_HAS_REGSLICE 4 \
  CONFIG.M03_HAS_REGSLICE 4 \
  CONFIG.M04_HAS_REGSLICE 4 \
  CONFIG.M05_HAS_REGSLICE 4 \
  CONFIG.M06_HAS_REGSLICE 4 \
  CONFIG.M07_HAS_REGSLICE 4 \
  CONFIG.M08_HAS_REGSLICE 4 \
  CONFIG.M09_HAS_REGSLICE 4 \
  CONFIG.M10_HAS_REGSLICE 4 \
  CONFIG.M11_HAS_REGSLICE 4 \
  CONFIG.M12_HAS_REGSLICE 4 \
  CONFIG.M13_HAS_REGSLICE 4 \
  CONFIG.M14_HAS_REGSLICE 4 \
  CONFIG.M15_HAS_REGSLICE 4 \
  CONFIG.M16_HAS_REGSLICE 4 \
  CONFIG.M17_HAS_REGSLICE 4 \
  CONFIG.M18_HAS_REGSLICE 4 \
  CONFIG.M19_HAS_REGSLICE 4 \
  CONFIG.M20_HAS_REGSLICE 4 \
  CONFIG.M21_HAS_REGSLICE 4 \
  CONFIG.M22_HAS_REGSLICE 4 \
  CONFIG.M23_HAS_REGSLICE 4 \
  CONFIG.M24_HAS_REGSLICE 4 \
  CONFIG.M25_HAS_REGSLICE 4 \
  CONFIG.M26_HAS_REGSLICE 4 \
  CONFIG.M27_HAS_REGSLICE 4 \
  CONFIG.M28_HAS_REGSLICE 4 \
  CONFIG.M29_HAS_REGSLICE 4 \
  CONFIG.M30_HAS_REGSLICE 4 \
  CONFIG.M31_HAS_REGSLICE 4 \
  CONFIG.M32_HAS_REGSLICE 4 \
  CONFIG.M33_HAS_REGSLICE 4 \
  CONFIG.M34_HAS_REGSLICE 4 \
  CONFIG.M35_HAS_REGSLICE 4 \
  CONFIG.M36_HAS_REGSLICE 4 \
  CONFIG.M37_HAS_REGSLICE 4 \
  CONFIG.M38_HAS_REGSLICE 4 \
  CONFIG.M39_HAS_REGSLICE 4 \
  CONFIG.M40_HAS_REGSLICE 4 \
  CONFIG.M41_HAS_REGSLICE 4 \
  CONFIG.M42_HAS_REGSLICE 4 \
  CONFIG.M43_HAS_REGSLICE 4 \
  CONFIG.M44_HAS_REGSLICE 4 \
  CONFIG.M45_HAS_REGSLICE 4 \
  CONFIG.M46_HAS_REGSLICE 4 \
  CONFIG.M47_HAS_REGSLICE 4 \
  CONFIG.M48_HAS_REGSLICE 4 \
  CONFIG.M49_HAS_REGSLICE 4 \
  CONFIG.M50_HAS_REGSLICE 4 \
  CONFIG.M51_HAS_REGSLICE 4 \
  CONFIG.M52_HAS_REGSLICE 4 \
  CONFIG.M53_HAS_REGSLICE 4 \
  CONFIG.M54_HAS_REGSLICE 4 \
  CONFIG.M55_HAS_REGSLICE 4 \
  CONFIG.M56_HAS_REGSLICE 4 \
  CONFIG.M57_HAS_REGSLICE 4 \
  CONFIG.M58_HAS_REGSLICE 4 \
  CONFIG.M59_HAS_REGSLICE 4 \
  CONFIG.M60_HAS_REGSLICE 4 \
  CONFIG.M61_HAS_REGSLICE 4 \
  CONFIG.M62_HAS_REGSLICE 4 \
  CONFIG.M63_HAS_REGSLICE 4 \
  CONFIG.NUM_MI 1 \
  CONFIG.NUM_SI 2 \
  CONFIG.S00_HAS_REGSLICE 4 \
  CONFIG.S01_HAS_DATA_FIFO 2 \
  CONFIG.S01_HAS_REGSLICE 1 \
] [get_bd_cells axi_interconnect_0]
create_bd_cell -type ip -vlnv xilinx.com:ip:axi_interconnect:2.1 axi_interconnect_1
set_property -dict [list \
  CONFIG.M00_HAS_REGSLICE 4 \
  CONFIG.M01_HAS_REGSLICE 4 \
  CONFIG.M02_HAS_REGSLICE 4 \
  CONFIG.M03_HAS_REGSLICE 4 \
  CONFIG.M04_HAS_REGSLICE 4 \
  CONFIG.M05_HAS_REGSLICE 4 \
  CONFIG.M06_HAS_REGSLICE 4 \
  CONFIG.M07_HAS_REGSLICE 4 \
  CONFIG.M08_HAS_REGSLICE 4 \
  CONFIG.M09_HAS_REGSLICE 4 \
  CONFIG.M10_HAS_REGSLICE 4 \
  CONFIG.M11_HAS_REGSLICE 4 \
  CONFIG.M12_HAS_REGSLICE 4 \
  CONFIG.M13_HAS_REGSLICE 4 \
  CONFIG.M14_HAS_REGSLICE 4 \
  CONFIG.M15_HAS_REGSLICE 4 \
  CONFIG.M16_HAS_REGSLICE 4 \
  CONFIG.M17_HAS_REGSLICE 4 \
  CONFIG.M18_HAS_REGSLICE 4 \
  CONFIG.M19_HAS_REGSLICE 4 \
  CONFIG.M20_HAS_REGSLICE 4 \
  CONFIG.M21_HAS_REGSLICE 4 \
  CONFIG.M22_HAS_REGSLICE 4 \
  CONFIG.M23_HAS_REGSLICE 4 \
  CONFIG.M24_HAS_REGSLICE 4 \
  CONFIG.M25_HAS_REGSLICE 4 \
  CONFIG.M26_HAS_REGSLICE 4 \
  CONFIG.M27_HAS_REGSLICE 4 \
  CONFIG.M28_HAS_REGSLICE 4 \
  CONFIG.M29_HAS_REGSLICE 4 \
  CONFIG.M30_HAS_REGSLICE 4 \
  CONFIG.M31_HAS_REGSLICE 4 \
  CONFIG.M32_HAS_REGSLICE 4 \
  CONFIG.M33_HAS_REGSLICE 4 \
  CONFIG.M34_HAS_REGSLICE 4 \
  CONFIG.M35_HAS_REGSLICE 4 \
  CONFIG.M36_HAS_REGSLICE 4 \
  CONFIG.M37_HAS_REGSLICE 4 \
  CONFIG.M38_HAS_REGSLICE 4 \
  CONFIG.M39_HAS_REGSLICE 4 \
  CONFIG.M40_HAS_REGSLICE 4 \
  CONFIG.M41_HAS_REGSLICE 4 \
  CONFIG.M42_HAS_REGSLICE 4 \
  CONFIG.M43_HAS_REGSLICE 4 \
  CONFIG.M44_HAS_REGSLICE 4 \
  CONFIG.M45_HAS_REGSLICE 4 \
  CONFIG.M46_HAS_REGSLICE 4 \
  CONFIG.M47_HAS_REGSLICE 4 \
  CONFIG.M48_HAS_REGSLICE 4 \
  CONFIG.M49_HAS_REGSLICE 4 \
  CONFIG.M50_HAS_REGSLICE 4 \
  CONFIG.M51_HAS_REGSLICE 4 \
  CONFIG.M52_HAS_REGSLICE 4 \
  CONFIG.M53_HAS_REGSLICE 4 \
  CONFIG.M54_HAS_REGSLICE 4 \
  CONFIG.M55_HAS_REGSLICE 4 \
  CONFIG.M56_HAS_REGSLICE 4 \
  CONFIG.M57_HAS_REGSLICE 4 \
  CONFIG.M58_HAS_REGSLICE 4 \
  CONFIG.M59_HAS_REGSLICE 4 \
  CONFIG.M60_HAS_REGSLICE 4 \
  CONFIG.M61_HAS_REGSLICE 4 \
  CONFIG.M62_HAS_REGSLICE 4 \
  CONFIG.M63_HAS_REGSLICE 4 \
  CONFIG.NUM_MI 1 \
  CONFIG.NUM_SI 1 \
  CONFIG.S00_HAS_REGSLICE 4 \
] [get_bd_cells axi_interconnect_1]
create_bd_cell -type ip -vlnv xilinx.com:ip:axi_interconnect:2.1 axi_interconnect_hpm0fpd
set_property -dict [list \
  CONFIG.M00_HAS_REGSLICE 4 \
  CONFIG.M01_HAS_REGSLICE 4 \
  CONFIG.M02_HAS_REGSLICE 4 \
  CONFIG.M03_HAS_REGSLICE 4 \
  CONFIG.M04_HAS_REGSLICE 4 \
  CONFIG.M05_HAS_REGSLICE 4 \
  CONFIG.M06_HAS_REGSLICE 4 \
  CONFIG.M07_HAS_REGSLICE 4 \
  CONFIG.M08_HAS_REGSLICE 4 \
  CONFIG.M09_HAS_REGSLICE 4 \
  CONFIG.M10_HAS_REGSLICE 4 \
  CONFIG.M11_HAS_REGSLICE 4 \
  CONFIG.M12_HAS_REGSLICE 4 \
  CONFIG.M13_HAS_REGSLICE 4 \
  CONFIG.M14_HAS_REGSLICE 4 \
  CONFIG.M15_HAS_REGSLICE 4 \
  CONFIG.M16_HAS_REGSLICE 4 \
  CONFIG.M17_HAS_REGSLICE 4 \
  CONFIG.M18_HAS_REGSLICE 4 \
  CONFIG.M19_HAS_REGSLICE 4 \
  CONFIG.M20_HAS_REGSLICE 4 \
  CONFIG.M21_HAS_REGSLICE 4 \
  CONFIG.M22_HAS_REGSLICE 4 \
  CONFIG.M23_HAS_REGSLICE 4 \
  CONFIG.M24_HAS_REGSLICE 4 \
  CONFIG.M25_HAS_REGSLICE 4 \
  CONFIG.M26_HAS_REGSLICE 4 \
  CONFIG.M27_HAS_REGSLICE 4 \
  CONFIG.M28_HAS_REGSLICE 4 \
  CONFIG.M29_HAS_REGSLICE 4 \
  CONFIG.M30_HAS_REGSLICE 4 \
  CONFIG.M31_HAS_REGSLICE 4 \
  CONFIG.M32_HAS_REGSLICE 4 \
  CONFIG.M33_HAS_REGSLICE 4 \
  CONFIG.M34_HAS_REGSLICE 4 \
  CONFIG.M35_HAS_REGSLICE 4 \
  CONFIG.M36_HAS_REGSLICE 4 \
  CONFIG.M37_HAS_REGSLICE 4 \
  CONFIG.M38_HAS_REGSLICE 4 \
  CONFIG.M39_HAS_REGSLICE 4 \
  CONFIG.M40_HAS_REGSLICE 4 \
  CONFIG.M41_HAS_REGSLICE 4 \
  CONFIG.M42_HAS_REGSLICE 4 \
  CONFIG.M43_HAS_REGSLICE 4 \
  CONFIG.M44_HAS_REGSLICE 4 \
  CONFIG.M45_HAS_REGSLICE 4 \
  CONFIG.M46_HAS_REGSLICE 4 \
  CONFIG.M47_HAS_REGSLICE 4 \
  CONFIG.M48_HAS_REGSLICE 4 \
  CONFIG.M49_HAS_REGSLICE 4 \
  CONFIG.M50_HAS_REGSLICE 4 \
  CONFIG.M51_HAS_REGSLICE 4 \
  CONFIG.M52_HAS_REGSLICE 4 \
  CONFIG.M53_HAS_REGSLICE 4 \
  CONFIG.M54_HAS_REGSLICE 4 \
  CONFIG.M55_HAS_REGSLICE 4 \
  CONFIG.M56_HAS_REGSLICE 4 \
  CONFIG.M57_HAS_REGSLICE 4 \
  CONFIG.M58_HAS_REGSLICE 4 \
  CONFIG.M59_HAS_REGSLICE 4 \
  CONFIG.M60_HAS_REGSLICE 4 \
  CONFIG.M61_HAS_REGSLICE 4 \
  CONFIG.M62_HAS_REGSLICE 4 \
  CONFIG.M63_HAS_REGSLICE 4 \
  CONFIG.NUM_MI 1 \
  CONFIG.S00_HAS_REGSLICE 4 \
] [get_bd_cells axi_interconnect_hpm0fpd]
create_bd_cell -type ip -vlnv xilinx.com:ip:axi_interconnect:2.1 interconnect_axifull_1_user_slr1
set_property -dict [list \
  CONFIG.M00_HAS_REGSLICE 4 \
  CONFIG.M01_HAS_REGSLICE 4 \
  CONFIG.M02_HAS_REGSLICE 4 \
  CONFIG.M03_HAS_REGSLICE 4 \
  CONFIG.M04_HAS_REGSLICE 4 \
  CONFIG.M05_HAS_REGSLICE 4 \
  CONFIG.M06_HAS_REGSLICE 4 \
  CONFIG.M07_HAS_REGSLICE 4 \
  CONFIG.M08_HAS_REGSLICE 4 \
  CONFIG.M09_HAS_REGSLICE 4 \
  CONFIG.M10_HAS_REGSLICE 4 \
  CONFIG.M11_HAS_REGSLICE 4 \
  CONFIG.M12_HAS_REGSLICE 4 \
  CONFIG.M13_HAS_REGSLICE 4 \
  CONFIG.M14_HAS_REGSLICE 4 \
  CONFIG.M15_HAS_REGSLICE 4 \
  CONFIG.M16_HAS_REGSLICE 4 \
  CONFIG.M17_HAS_REGSLICE 4 \
  CONFIG.M18_HAS_REGSLICE 4 \
  CONFIG.M19_HAS_REGSLICE 4 \
  CONFIG.M20_HAS_REGSLICE 4 \
  CONFIG.M21_HAS_REGSLICE 4 \
  CONFIG.M22_HAS_REGSLICE 4 \
  CONFIG.M23_HAS_REGSLICE 4 \
  CONFIG.M24_HAS_REGSLICE 4 \
  CONFIG.M25_HAS_REGSLICE 4 \
  CONFIG.M26_HAS_REGSLICE 4 \
  CONFIG.M27_HAS_REGSLICE 4 \
  CONFIG.M28_HAS_REGSLICE 4 \
  CONFIG.M29_HAS_REGSLICE 4 \
  CONFIG.M30_HAS_REGSLICE 4 \
  CONFIG.M31_HAS_REGSLICE 4 \
  CONFIG.M32_HAS_REGSLICE 4 \
  CONFIG.M33_HAS_REGSLICE 4 \
  CONFIG.M34_HAS_REGSLICE 4 \
  CONFIG.M35_HAS_REGSLICE 4 \
  CONFIG.M36_HAS_REGSLICE 4 \
  CONFIG.M37_HAS_REGSLICE 4 \
  CONFIG.M38_HAS_REGSLICE 4 \
  CONFIG.M39_HAS_REGSLICE 4 \
  CONFIG.M40_HAS_REGSLICE 4 \
  CONFIG.M41_HAS_REGSLICE 4 \
  CONFIG.M42_HAS_REGSLICE 4 \
  CONFIG.M43_HAS_REGSLICE 4 \
  CONFIG.M44_HAS_REGSLICE 4 \
  CONFIG.M45_HAS_REGSLICE 4 \
  CONFIG.M46_HAS_REGSLICE 4 \
  CONFIG.M47_HAS_REGSLICE 4 \
  CONFIG.M48_HAS_REGSLICE 4 \
  CONFIG.M49_HAS_REGSLICE 4 \
  CONFIG.M50_HAS_REGSLICE 4 \
  CONFIG.M51_HAS_REGSLICE 4 \
  CONFIG.M52_HAS_REGSLICE 4 \
  CONFIG.M53_HAS_REGSLICE 4 \
  CONFIG.M54_HAS_REGSLICE 4 \
  CONFIG.M55_HAS_REGSLICE 4 \
  CONFIG.M56_HAS_REGSLICE 4 \
  CONFIG.M57_HAS_REGSLICE 4 \
  CONFIG.M58_HAS_REGSLICE 4 \
  CONFIG.M59_HAS_REGSLICE 4 \
  CONFIG.M60_HAS_REGSLICE 4 \
  CONFIG.M61_HAS_REGSLICE 4 \
  CONFIG.M62_HAS_REGSLICE 4 \
  CONFIG.M63_HAS_REGSLICE 4 \
  CONFIG.NUM_MI 1 \
  CONFIG.NUM_SI 1 \
  CONFIG.S00_HAS_REGSLICE 4 \
] [get_bd_cells interconnect_axifull_1_user_slr1]
create_bd_cell -type ip -vlnv xilinx.com:ip:axi_interconnect:2.1 interconnect_axifull_2_user_slr1
set_property -dict [list \
  CONFIG.M00_HAS_REGSLICE 4 \
  CONFIG.M01_HAS_REGSLICE 4 \
  CONFIG.M02_HAS_REGSLICE 4 \
  CONFIG.M03_HAS_REGSLICE 4 \
  CONFIG.M04_HAS_REGSLICE 4 \
  CONFIG.M05_HAS_REGSLICE 4 \
  CONFIG.M06_HAS_REGSLICE 4 \
  CONFIG.M07_HAS_REGSLICE 4 \
  CONFIG.M08_HAS_REGSLICE 4 \
  CONFIG.M09_HAS_REGSLICE 4 \
  CONFIG.M10_HAS_REGSLICE 4 \
  CONFIG.M11_HAS_REGSLICE 4 \
  CONFIG.M12_HAS_REGSLICE 4 \
  CONFIG.M13_HAS_REGSLICE 4 \
  CONFIG.M14_HAS_REGSLICE 4 \
  CONFIG.M15_HAS_REGSLICE 4 \
  CONFIG.M16_HAS_REGSLICE 4 \
  CONFIG.M17_HAS_REGSLICE 4 \
  CONFIG.M18_HAS_REGSLICE 4 \
  CONFIG.M19_HAS_REGSLICE 4 \
  CONFIG.M20_HAS_REGSLICE 4 \
  CONFIG.M21_HAS_REGSLICE 4 \
  CONFIG.M22_HAS_REGSLICE 4 \
  CONFIG.M23_HAS_REGSLICE 4 \
  CONFIG.M24_HAS_REGSLICE 4 \
  CONFIG.M25_HAS_REGSLICE 4 \
  CONFIG.M26_HAS_REGSLICE 4 \
  CONFIG.M27_HAS_REGSLICE 4 \
  CONFIG.M28_HAS_REGSLICE 4 \
  CONFIG.M29_HAS_REGSLICE 4 \
  CONFIG.M30_HAS_REGSLICE 4 \
  CONFIG.M31_HAS_REGSLICE 4 \
  CONFIG.M32_HAS_REGSLICE 4 \
  CONFIG.M33_HAS_REGSLICE 4 \
  CONFIG.M34_HAS_REGSLICE 4 \
  CONFIG.M35_HAS_REGSLICE 4 \
  CONFIG.M36_HAS_REGSLICE 4 \
  CONFIG.M37_HAS_REGSLICE 4 \
  CONFIG.M38_HAS_REGSLICE 4 \
  CONFIG.M39_HAS_REGSLICE 4 \
  CONFIG.M40_HAS_REGSLICE 4 \
  CONFIG.M41_HAS_REGSLICE 4 \
  CONFIG.M42_HAS_REGSLICE 4 \
  CONFIG.M43_HAS_REGSLICE 4 \
  CONFIG.M44_HAS_REGSLICE 4 \
  CONFIG.M45_HAS_REGSLICE 4 \
  CONFIG.M46_HAS_REGSLICE 4 \
  CONFIG.M47_HAS_REGSLICE 4 \
  CONFIG.M48_HAS_REGSLICE 4 \
  CONFIG.M49_HAS_REGSLICE 4 \
  CONFIG.M50_HAS_REGSLICE 4 \
  CONFIG.M51_HAS_REGSLICE 4 \
  CONFIG.M52_HAS_REGSLICE 4 \
  CONFIG.M53_HAS_REGSLICE 4 \
  CONFIG.M54_HAS_REGSLICE 4 \
  CONFIG.M55_HAS_REGSLICE 4 \
  CONFIG.M56_HAS_REGSLICE 4 \
  CONFIG.M57_HAS_REGSLICE 4 \
  CONFIG.M58_HAS_REGSLICE 4 \
  CONFIG.M59_HAS_REGSLICE 4 \
  CONFIG.M60_HAS_REGSLICE 4 \
  CONFIG.M61_HAS_REGSLICE 4 \
  CONFIG.M62_HAS_REGSLICE 4 \
  CONFIG.M63_HAS_REGSLICE 4 \
  CONFIG.NUM_MI 1 \
  CONFIG.NUM_SI 3 \
  CONFIG.S00_HAS_REGSLICE 4 \
  CONFIG.S01_HAS_DATA_FIFO 2 \
  CONFIG.S01_HAS_REGSLICE 1 \
  CONFIG.S02_HAS_DATA_FIFO 2 \
  CONFIG.S02_HAS_REGSLICE 1 \
] [get_bd_cells interconnect_axifull_2_user_slr1]
create_bd_cell -type ip -vlnv xilinx.com:ip:axi_interconnect:2.1 interconnect_axilite_user_slr1
set_property -dict [list \
  CONFIG.M00_HAS_REGSLICE 4 \
  CONFIG.M01_HAS_REGSLICE 1 \
  CONFIG.M02_HAS_REGSLICE 4 \
  CONFIG.M03_HAS_REGSLICE 4 \
  CONFIG.M04_HAS_REGSLICE 4 \
  CONFIG.M05_HAS_REGSLICE 4 \
  CONFIG.M06_HAS_REGSLICE 4 \
  CONFIG.M07_HAS_REGSLICE 4 \
  CONFIG.M08_HAS_REGSLICE 4 \
  CONFIG.M09_HAS_REGSLICE 4 \
  CONFIG.M10_HAS_REGSLICE 4 \
  CONFIG.M11_HAS_REGSLICE 4 \
  CONFIG.M12_HAS_REGSLICE 4 \
  CONFIG.M13_HAS_REGSLICE 4 \
  CONFIG.M14_HAS_REGSLICE 4 \
  CONFIG.M15_HAS_REGSLICE 4 \
  CONFIG.M16_HAS_REGSLICE 4 \
  CONFIG.M17_HAS_REGSLICE 4 \
  CONFIG.M18_HAS_REGSLICE 4 \
  CONFIG.M19_HAS_REGSLICE 4 \
  CONFIG.M20_HAS_REGSLICE 4 \
  CONFIG.M21_HAS_REGSLICE 4 \
  CONFIG.M22_HAS_REGSLICE 4 \
  CONFIG.M23_HAS_REGSLICE 4 \
  CONFIG.M24_HAS_REGSLICE 4 \
  CONFIG.M25_HAS_REGSLICE 4 \
  CONFIG.M26_HAS_REGSLICE 4 \
  CONFIG.M27_HAS_REGSLICE 4 \
  CONFIG.M28_HAS_REGSLICE 4 \
  CONFIG.M29_HAS_REGSLICE 4 \
  CONFIG.M30_HAS_REGSLICE 4 \
  CONFIG.M31_HAS_REGSLICE 4 \
  CONFIG.M32_HAS_REGSLICE 4 \
  CONFIG.M33_HAS_REGSLICE 4 \
  CONFIG.M34_HAS_REGSLICE 4 \
  CONFIG.M35_HAS_REGSLICE 4 \
  CONFIG.M36_HAS_REGSLICE 4 \
  CONFIG.M37_HAS_REGSLICE 4 \
  CONFIG.M38_HAS_REGSLICE 4 \
  CONFIG.M39_HAS_REGSLICE 4 \
  CONFIG.M40_HAS_REGSLICE 4 \
  CONFIG.M41_HAS_REGSLICE 4 \
  CONFIG.M42_HAS_REGSLICE 4 \
  CONFIG.M43_HAS_REGSLICE 4 \
  CONFIG.M44_HAS_REGSLICE 4 \
  CONFIG.M45_HAS_REGSLICE 4 \
  CONFIG.M46_HAS_REGSLICE 4 \
  CONFIG.M47_HAS_REGSLICE 4 \
  CONFIG.M48_HAS_REGSLICE 4 \
  CONFIG.M49_HAS_REGSLICE 4 \
  CONFIG.M50_HAS_REGSLICE 4 \
  CONFIG.M51_HAS_REGSLICE 4 \
  CONFIG.M52_HAS_REGSLICE 4 \
  CONFIG.M53_HAS_REGSLICE 4 \
  CONFIG.M54_HAS_REGSLICE 4 \
  CONFIG.M55_HAS_REGSLICE 4 \
  CONFIG.M56_HAS_REGSLICE 4 \
  CONFIG.M57_HAS_REGSLICE 4 \
  CONFIG.M58_HAS_REGSLICE 4 \
  CONFIG.M59_HAS_REGSLICE 4 \
  CONFIG.M60_HAS_REGSLICE 4 \
  CONFIG.M61_HAS_REGSLICE 4 \
  CONFIG.M62_HAS_REGSLICE 4 \
  CONFIG.M63_HAS_REGSLICE 4 \
  CONFIG.NUM_MI 2 \
  CONFIG.NUM_SI 1 \
  CONFIG.S00_HAS_REGSLICE 4 \
] [get_bd_cells interconnect_axilite_user_slr1]
create_bd_cell -type ip -vlnv xilinx.com:hls:digitcaps_accel:1.0 digitcaps_accel_1

# ---- hierarchy /interrupt_concat ----
current_bd_instance /interrupt_concat
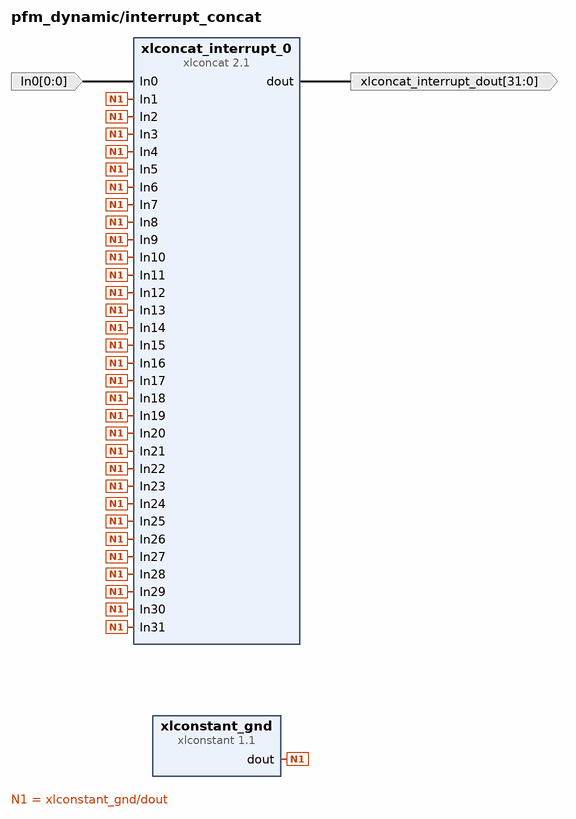
[diagram p5: block diagram inside /interrupt_concat]
create_bd_pin -dir O -from 31 -to 0 xlconcat_interrupt_dout
create_bd_pin -dir I -from 0 -to 0 In0

create_bd_cell -type ip -vlnv xilinx.com:ip:xlconcat:2.1 xlconcat_interrupt_0
set_property -dict {CONFIG.NUM_PORTS 32} [get_bd_cells xlconcat_interrupt_0]
create_bd_cell -type ip -vlnv xilinx.com:ip:xlconstant:1.1 xlconstant_gnd
set_property -dict {CONFIG.CONST_VAL 0} [get_bd_cells xlconstant_gnd]

# ---- hierarchy /reset_controllers ----
current_bd_instance /reset_controllers
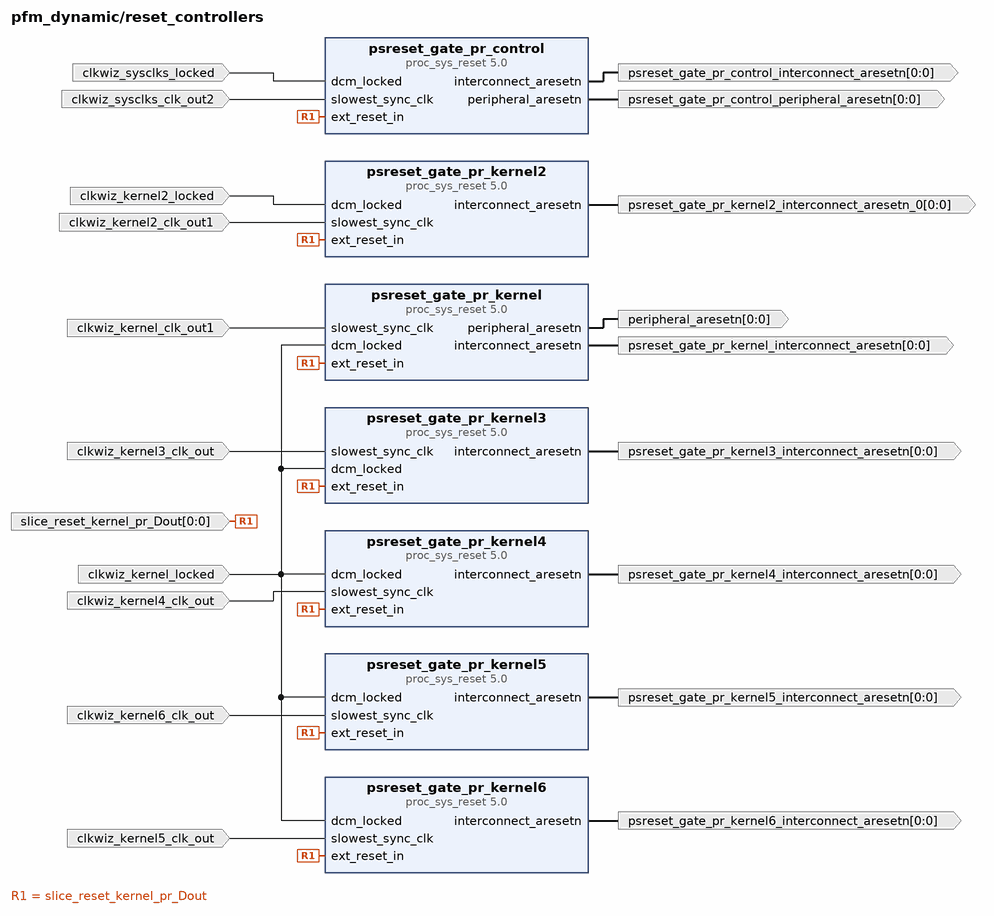
[diagram p6: block diagram inside /reset_controllers]
create_bd_pin -dir I -type clk clkwiz_kernel2_clk_out1
create_bd_pin -dir I clkwiz_kernel2_locked
create_bd_pin -dir I -type clk clkwiz_kernel3_clk_out
create_bd_pin -dir I -type clk clkwiz_kernel4_clk_out
create_bd_pin -dir I -type clk clkwiz_kernel5_clk_out
create_bd_pin -dir I -type clk clkwiz_kernel6_clk_out
create_bd_pin -dir I -type clk clkwiz_kernel_clk_out1
create_bd_pin -dir I clkwiz_kernel_locked
create_bd_pin -dir I -type clk clkwiz_sysclks_clk_out2
create_bd_pin -dir I clkwiz_sysclks_locked
create_bd_pin -dir O -from 0 -to 0 -type rst psreset_gate_pr_control_interconnect_aresetn
create_bd_pin -dir O -from 0 -to 0 -type rst psreset_gate_pr_control_peripheral_aresetn
create_bd_pin -dir O -from 0 -to 0 -type rst psreset_gate_pr_kernel2_interconnect_aresetn_0
create_bd_pin -dir O -from 0 -to 0 -type rst psreset_gate_pr_kernel_interconnect_aresetn
create_bd_pin -dir O -from 0 -to 0 -type rst psreset_gate_pr_kernel3_interconnect_aresetn
create_bd_pin -dir O -from 0 -to 0 -type rst psreset_gate_pr_kernel4_interconnect_aresetn
create_bd_pin -dir O -from 0 -to 0 -type rst psreset_gate_pr_kernel5_interconnect_aresetn
create_bd_pin -dir O -from 0 -to 0 -type rst psreset_gate_pr_kernel6_interconnect_aresetn
create_bd_pin -dir I -from 0 -to 0 -type rst slice_reset_kernel_pr_Dout
create_bd_pin -dir O -from 0 -to 0 -type rst peripheral_aresetn

create_bd_cell -type ip -vlnv xilinx.com:ip:proc_sys_reset:5.0 psreset_gate_pr_control
set_property -dict {CONFIG.C_AUX_RST_WIDTH 1 CONFIG.C_EXT_RST_WIDTH 1} [get_bd_cells psreset_gate_pr_control]
create_bd_cell -type ip -vlnv xilinx.com:ip:proc_sys_reset:5.0 psreset_gate_pr_kernel
set_property -dict {CONFIG.C_AUX_RST_WIDTH 1 CONFIG.C_EXT_RST_WIDTH 1} [get_bd_cells psreset_gate_pr_kernel]
create_bd_cell -type ip -vlnv xilinx.com:ip:proc_sys_reset:5.0 psreset_gate_pr_kernel2
set_property -dict {CONFIG.C_AUX_RST_WIDTH 1 CONFIG.C_EXT_RST_WIDTH 1} [get_bd_cells psreset_gate_pr_kernel2]
create_bd_cell -type ip -vlnv xilinx.com:ip:proc_sys_reset:5.0 psreset_gate_pr_kernel3
set_property -dict {CONFIG.C_AUX_RST_WIDTH 1 CONFIG.C_EXT_RST_WIDTH 1} [get_bd_cells psreset_gate_pr_kernel3]
create_bd_cell -type ip -vlnv xilinx.com:ip:proc_sys_reset:5.0 psreset_gate_pr_kernel4
set_property -dict {CONFIG.C_AUX_RST_WIDTH 1 CONFIG.C_EXT_RST_WIDTH 1} [get_bd_cells psreset_gate_pr_kernel4]
create_bd_cell -type ip -vlnv xilinx.com:ip:proc_sys_reset:5.0 psreset_gate_pr_kernel5
set_property -dict {CONFIG.C_AUX_RST_WIDTH 1 CONFIG.C_EXT_RST_WIDTH 1} [get_bd_cells psreset_gate_pr_kernel5]
create_bd_cell -type ip -vlnv xilinx.com:ip:proc_sys_reset:5.0 psreset_gate_pr_kernel6
set_property -dict {CONFIG.C_AUX_RST_WIDTH 1 CONFIG.C_EXT_RST_WIDTH 1} [get_bd_cells psreset_gate_pr_kernel6]

# ---- connections ----

current_bd_instance /interrupt_concat
connect_bd_net -net In0_1 [get_bd_pins In0] [get_bd_pins xlconcat_interrupt_0/In0]
connect_bd_net [get_bd_pins xlconcat_interrupt_0/dout] [get_bd_pins xlconcat_interrupt_dout]
connect_bd_net [get_bd_pins xlconstant_gnd/dout] \
  [get_bd_pins xlconcat_interrupt_0/In1] [get_bd_pins xlconcat_interrupt_0/In2] [get_bd_pins xlconcat_interrupt_0/In3] \
  [get_bd_pins xlconcat_interrupt_0/In4] [get_bd_pins xlconcat_interrupt_0/In5] [get_bd_pins xlconcat_interrupt_0/In6] \
  [get_bd_pins xlconcat_interrupt_0/In7] [get_bd_pins xlconcat_interrupt_0/In8] [get_bd_pins xlconcat_interrupt_0/In9] \
  [get_bd_pins xlconcat_interrupt_0/In10] [get_bd_pins xlconcat_interrupt_0/In11] [get_bd_pins xlconcat_interrupt_0/In12] \
  [get_bd_pins xlconcat_interrupt_0/In13] [get_bd_pins xlconcat_interrupt_0/In14] [get_bd_pins xlconcat_interrupt_0/In15] \
  [get_bd_pins xlconcat_interrupt_0/In16] [get_bd_pins xlconcat_interrupt_0/In17] [get_bd_pins xlconcat_interrupt_0/In18] \
  [get_bd_pins xlconcat_interrupt_0/In19] [get_bd_pins xlconcat_interrupt_0/In20] [get_bd_pins xlconcat_interrupt_0/In21] \
  [get_bd_pins xlconcat_interrupt_0/In22] [get_bd_pins xlconcat_interrupt_0/In23] [get_bd_pins xlconcat_interrupt_0/In24] \
  [get_bd_pins xlconcat_interrupt_0/In25] [get_bd_pins xlconcat_interrupt_0/In26] [get_bd_pins xlconcat_interrupt_0/In27] \
  [get_bd_pins xlconcat_interrupt_0/In28] [get_bd_pins xlconcat_interrupt_0/In29] [get_bd_pins xlconcat_interrupt_0/In30] \
  [get_bd_pins xlconcat_interrupt_0/In31]

current_bd_instance /reset_controllers
connect_bd_net [get_bd_pins clkwiz_kernel3_clk_out] [get_bd_pins psreset_gate_pr_kernel3/slowest_sync_clk]
connect_bd_net [get_bd_pins clkwiz_kernel4_clk_out] [get_bd_pins psreset_gate_pr_kernel4/slowest_sync_clk]
connect_bd_net [get_bd_pins clkwiz_kernel5_clk_out] [get_bd_pins psreset_gate_pr_kernel6/slowest_sync_clk]
connect_bd_net [get_bd_pins clkwiz_kernel6_clk_out] [get_bd_pins psreset_gate_pr_kernel5/slowest_sync_clk]
connect_bd_net [get_bd_pins clkwiz_kernel_clk_out1] [get_bd_pins psreset_gate_pr_kernel/slowest_sync_clk]
connect_bd_net -net dcm_locked_1 [get_bd_pins clkwiz_kernel_locked] \
  [get_bd_pins psreset_gate_pr_kernel/dcm_locked] [get_bd_pins psreset_gate_pr_kernel3/dcm_locked] \
  [get_bd_pins psreset_gate_pr_kernel4/dcm_locked] [get_bd_pins psreset_gate_pr_kernel5/dcm_locked] \
  [get_bd_pins psreset_gate_pr_kernel6/dcm_locked]
connect_bd_net -net dcm_locked_2 [get_bd_pins clkwiz_sysclks_locked] [get_bd_pins psreset_gate_pr_control/dcm_locked]
connect_bd_net -net dcm_locked_4 [get_bd_pins clkwiz_kernel2_locked] [get_bd_pins psreset_gate_pr_kernel2/dcm_locked]
connect_bd_net -net ext_reset_in_1 [get_bd_pins slice_reset_kernel_pr_Dout] \
  [get_bd_pins psreset_gate_pr_control/ext_reset_in] [get_bd_pins psreset_gate_pr_kernel/ext_reset_in] \
  [get_bd_pins psreset_gate_pr_kernel2/ext_reset_in] [get_bd_pins psreset_gate_pr_kernel3/ext_reset_in] \
  [get_bd_pins psreset_gate_pr_kernel4/ext_reset_in] [get_bd_pins psreset_gate_pr_kernel5/ext_reset_in] \
  [get_bd_pins psreset_gate_pr_kernel6/ext_reset_in]
connect_bd_net [get_bd_pins psreset_gate_pr_control/interconnect_aresetn] [get_bd_pins psreset_gate_pr_control_interconnect_aresetn]
connect_bd_net [get_bd_pins psreset_gate_pr_control/peripheral_aresetn] [get_bd_pins psreset_gate_pr_control_peripheral_aresetn]
connect_bd_net [get_bd_pins psreset_gate_pr_kernel2/interconnect_aresetn] [get_bd_pins psreset_gate_pr_kernel2_interconnect_aresetn_0]
connect_bd_net [get_bd_pins psreset_gate_pr_kernel3/interconnect_aresetn] [get_bd_pins psreset_gate_pr_kernel3_interconnect_aresetn]
connect_bd_net [get_bd_pins psreset_gate_pr_kernel4/interconnect_aresetn] [get_bd_pins psreset_gate_pr_kernel4_interconnect_aresetn]
connect_bd_net [get_bd_pins psreset_gate_pr_kernel5/interconnect_aresetn] [get_bd_pins psreset_gate_pr_kernel5_interconnect_aresetn]
connect_bd_net [get_bd_pins psreset_gate_pr_kernel6/interconnect_aresetn] [get_bd_pins psreset_gate_pr_kernel6_interconnect_aresetn]
connect_bd_net [get_bd_pins psreset_gate_pr_kernel/interconnect_aresetn] [get_bd_pins psreset_gate_pr_kernel_interconnect_aresetn]
connect_bd_net [get_bd_pins psreset_gate_pr_kernel/peripheral_aresetn] [get_bd_pins peripheral_aresetn]
connect_bd_net -net slowest_sync_clk_1 [get_bd_pins clkwiz_sysclks_clk_out2] [get_bd_pins psreset_gate_pr_control/slowest_sync_clk]
connect_bd_net -net slowest_sync_clk_4 [get_bd_pins clkwiz_kernel2_clk_out1] [get_bd_pins psreset_gate_pr_kernel2/slowest_sync_clk]
